# Altium project Dashboard_10.0.PrjPcb
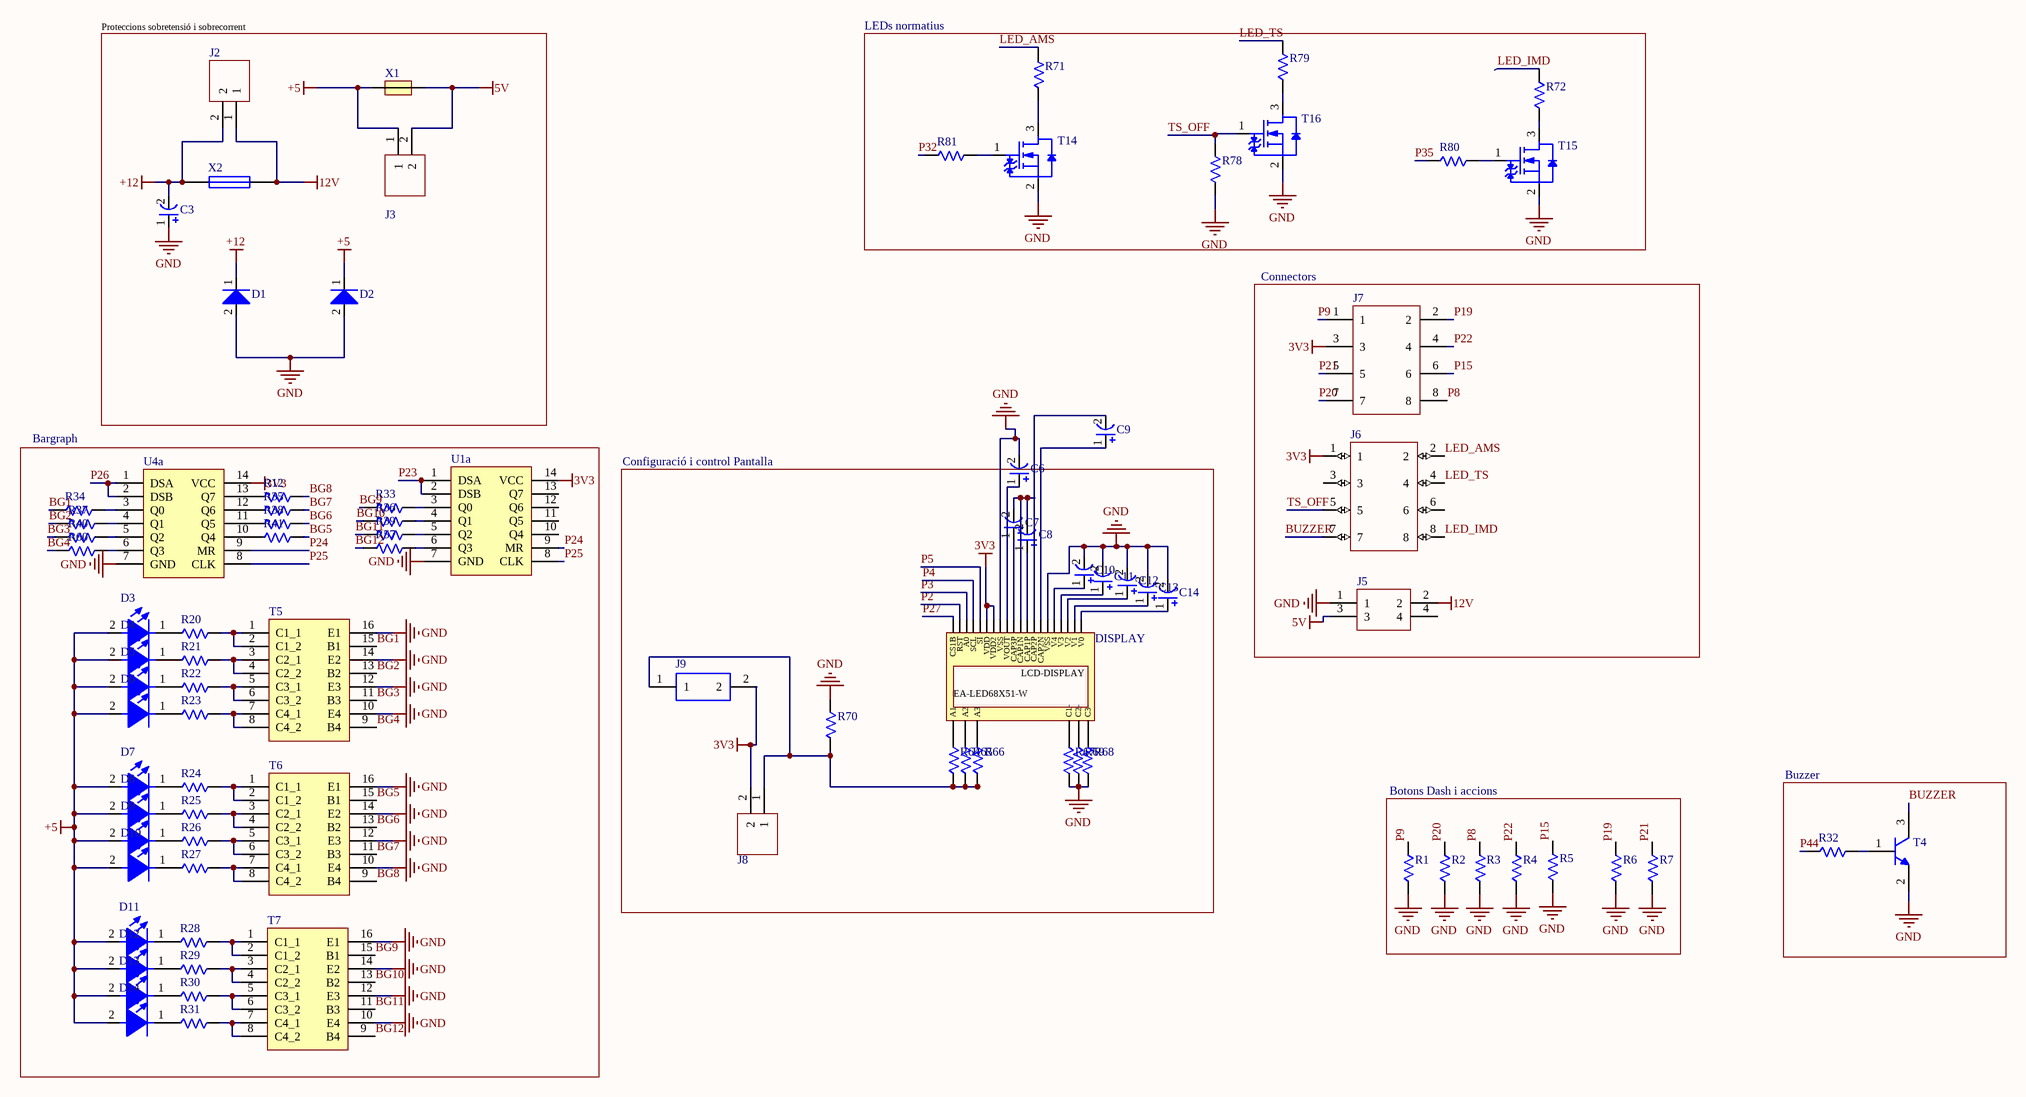
[diagram p0: DASH.SchDoc]
1 sheet, 88 parts. Net scope: global (net labels, ports and power ports of the same name join across sheets).
Board file: Dashboard_10.0.PcbDoc

## Sheet DASH.SchDoc
size A2

### Parts
C3  TAJA105K020RNJ  [Chip2PinSM127P600-8N(condensador)]  (value not drawn)
C6  TAJA105K020RNJ  [Chip2PinSM127P600-8N(condensador)]  (value not drawn)
C7  TAJA105K020RNJ  [Chip2PinSM127P600-8N(condensador)]  (value not drawn)
C8  TAJA105K020RNJ  [Chip2PinSM127P600-8N(condensador)]  (value not drawn)
C9  TAJA105K020RNJ  [Chip2PinSM127P600-8N(condensador)]  (value not drawn)
C10  TAJA105K020RNJ  [Chip2PinSM127P600-8N(condensador)]  (value not drawn)
C11  TAJA105K020RNJ  [Chip2PinSM127P600-8N(condensador)]  (value not drawn)
C12  TAJA105K020RNJ  [Chip2PinSM127P600-8N(condensador)]  (value not drawn)
C13  TAJA105K020RNJ  [Chip2PinSM127P600-8N(condensador)]  (value not drawn)
C14  TAJA105K020RNJ  [Chip2PinSM127P600-8N(condensador)]  (value not drawn)
D1  SMAJ12CA  [Diode]  (value not drawn)
D2  SMAJ12CA  [Diode]  (value not drawn)
D3  150141GS73100  [Chip2PinSM127P600-8N(Buzz)]  (value not drawn)
D4  150141GS73100  [Chip2PinSM127P600-8N(Buzz)]  (value not drawn)
D5  150141GS73100  [Chip2PinSM127P600-8N(Buzz)]  (value not drawn)
D6  150141GS73100  [Chip2PinSM127P600-8N(Buzz)]  (value not drawn)
D7  150141GS73100  [Chip2PinSM127P600-8N(Buzz)]  (value not drawn)
D8  150141GS73100  [Chip2PinSM127P600-8N(Buzz)]  (value not drawn)
D9  150141GS73100  [Chip2PinSM127P600-8N(Buzz)]  (value not drawn)
D10  150141GS73100  [Chip2PinSM127P600-8N(Buzz)]  (value not drawn)
D11  150141GS73100  [Chip2PinSM127P600-8N(Buzz)]  (value not drawn)
D12  150141GS73100  [Chip2PinSM127P600-8N(Buzz)]  (value not drawn)
D13  150141GS73100  [Chip2PinSM127P600-8N(Buzz)]  (value not drawn)
D14  150141GS73100  [Chip2PinSM127P600-8N(Buzz)]  (value not drawn)
DISPLAY  M20-7820442  [DISPLAY]  (value not drawn)
J2  68001-202HLF  [J2]  (value not drawn)
J3  68001-202HLF  [J3]  (value not drawn)
J5  1053141104  [J5]  (value not drawn)
J6  43045-0800  [J6]  (value not drawn)
J7  105314-1108  [J7]  (value not drawn)
J8  68001-202HLF  [J8]  (value not drawn)
J9  105313-1202  [J9]  (value not drawn)
R1  CRCW120610K0JNTA-ND  [ERJ-8GEYJ102V]  (value not drawn)
R2  CRCW120610K0JNTA-ND  [ERJ-8GEYJ102V]  (value not drawn)
R3  CRCW120610K0JNTA-ND  [ERJ-8GEYJ102V]  (value not drawn)
R4  CRCW120610K0JNTA-ND  [ERJ-8GEYJ102V]  (value not drawn)
R5  CRCW120610K0JNTA-ND  [ERJ-8GEYJ102V]  (value not drawn)
R6  CRCW120610K0JNTA-ND  [ERJ-8GEYJ102V]  (value not drawn)
R7  CRCW120610K0JNTA-ND  [ERJ-8GEYJ102V]  (value not drawn)
R12  ERJ-8GEYJ102V  [ERJ-8GEYJ102V]  (value not drawn)
R20  ERJ-8GEYJ151V  [ERJ-8GEYJ102V]  (value not drawn)
R21  ERJ-8GEYJ151V  [ERJ-8GEYJ102V]  (value not drawn)
R22  ERJ-8GEYJ151V  [ERJ-8GEYJ102V]  (value not drawn)
R23  ERJ-8GEYJ151V  [ERJ-8GEYJ102V]  (value not drawn)
R24  ERJ-8GEYJ151V  [ERJ-8GEYJ102V]  (value not drawn)
R25  ERJ-8GEYJ151V  [ERJ-8GEYJ102V]  (value not drawn)
R26  ERJ-8GEYJ151V  [ERJ-8GEYJ102V]  (value not drawn)
R27  ERJ-8GEYJ151V  [ERJ-8GEYJ102V]  (value not drawn)
R28  ERJ-8GEYJ151V  [ERJ-8GEYJ102V]  (value not drawn)
R29  ERJ-8GEYJ151V  [ERJ-8GEYJ102V]  (value not drawn)
R30  ERJ-8GEYJ151V  [ERJ-8GEYJ102V]  (value not drawn)
R31  ERJ-8GEYJ151V  [ERJ-8GEYJ102V]  (value not drawn)
R32  ERJ-8GEYJ102V  [ERJ-8GEYJ102V]  (value not drawn)
R33  ERJ-8GEYJ102V  [ERJ-8GEYJ102V]  (value not drawn)
R34  ERJ-8GEYJ102V  [ERJ-8GEYJ102V]  (value not drawn)
R35  ERJ-8GEYJ102V  [ERJ-8GEYJ102V]  (value not drawn)
R36  ERJ-8GEYJ102V  [ERJ-8GEYJ102V]  (value not drawn)
R37  ERJ-8GEYJ102V  [ERJ-8GEYJ102V]  (value not drawn)
R38  ERJ-8GEYJ102V  [ERJ-8GEYJ102V]  (value not drawn)
R39  ERJ-8GEYJ102V  [ERJ-8GEYJ102V]  (value not drawn)
R40  ERJ-8GEYJ102V  [ERJ-8GEYJ102V]  (value not drawn)
R41  ERJ-8GEYJ102V  [ERJ-8GEYJ102V]  (value not drawn)
R57  ERJ-8GEYJ102V  [ERJ-8GEYJ102V]  (value not drawn)
R60  ERJ-8GEYJ102V  [ERJ-8GEYJ102V]  (value not drawn)
R64  ERJ-8GEYJ102V  [ERJ-8GEYJ102V]  (value not drawn)
R65  ERJ-8GEYJ102V  [ERJ-8GEYJ102V]  (value not drawn)
R66  ERJ-8GEYJ102V  [ERJ-8GEYJ102V]  (value not drawn)
R67  ERJ-8GEYJ102V  [ERJ-8GEYJ102V]  (value not drawn)
R68  ERJ-8GEYJ102V  [ERJ-8GEYJ102V]  (value not drawn)
R69  ERJ-8GEYJ102V  [ERJ-8GEYJ102V]  (value not drawn)
R70  CRCW120610K0JNTA-ND  [ERJ-8GEYJ102V]  (value not drawn)
R71  ERJ-8GEYJ151V  [ERJ-8GEYJ102V]  (value not drawn)
R72  ERJ-8GEYJ151V  [ERJ-8GEYJ102V]  (value not drawn)
R78  CRCW120610K0JNTA-ND  [ERJ-8GEYJ102V]  (value not drawn)
R79  ERJ-8GEYJ151V  [ERJ-8GEYJ102V]  (value not drawn)
R80  ERJ-8GEYJ102V  [ERJ-8GEYJ102V]  (value not drawn)
R81  ERJ-8GEYJ102V  [ERJ-8GEYJ102V]  (value not drawn)
T4  BC817-25LT1G  [SOT190P240X100-3N]  (value not drawn)
T5  MMPQ2222A  [SOP127P600-8N(MMPQ2222A)]  (value not drawn)
T6  MMPQ2222A  [SOP127P600-8N(MMPQ2222A)]  (value not drawn)
T7  MMPQ2222A  [SOP127P600-8N(MMPQ2222A)]  (value not drawn)
T14  CPH3455-TL-H  [SOT190P280X90-3N]  (value not drawn)
T15  CPH3455-TL-H  [SOT190P280X90-3N]  (value not drawn)
T16  CPH3455-TL-H  [SOT190P280X90-3N]  (value not drawn)
U1a  SN74HC164D  [SOP127P600-8N]  (value not drawn)
U4a  SN74HC164D  [SOP127P600-8N]  (value not drawn)
X1  FUSE 3A  [Fuse]  (value not drawn)
X2  Fuse 1A  [Fuse]  (value not drawn)

### Blocks framed on the sheet
Proteccions sobretensió i sobrecorrent: C3 D1 D2 J2 J3 X1 X2
LEDs normatius: R71 R72 R78-R81 T14-T16
Connectors: J5-J7
Bargraph: D3-D14 R12 R20-R31 R33-R41 R57 R60 T5-T7 U1a U4a
Configuració i control Pantalla: C6-C8 C10-C14 DISPLAY J8 J9 R64-R70
Botons Dash i accions: R1-R7
Buzzer: R32 T4

### Nets
3V3: DISPLAY.34(VDD2) DISPLAY.35(VDD) J6.1 J7.3 J8.2 J9.2 U1a.14(VCC) U4a.14(VCC)
5V: J3.2 J5.3 X1.2
12V: J2.1 J5.2 X2.2
+5: D2.1(catode) D3.2(ANODE) D4.2(ANODE) D5.2(ANODE) D6.2(ANODE) D7.2(ANODE) D8.2(ANODE) D9.2(ANODE) D10.2(ANODE) D11.2(ANODE) D12.2(ANODE) D13.2(ANODE) D14.2(ANODE) J3.1 X1.1
+12: C3.2 D1.1(catode) J2.2 X2.1
GND: C3.1 C6.2 C10.2 C11.2 C12.2 C13.2 C14.2 D1.2(anode) D2.2(anode) DISPLAY.26(VSS) DISPLAY.33(VSS) J5.1 R1.1 R2.1 R3.1 R4.1 R5.1 R6.1 R7.1 R67.2 R68.2 R69.2 R70.2 R78.1 T4.2(Emitter) T5.10(E4) T5.12(E3) T5.14(E2) T5.16(E1) T6.10(E4) T6.12(E3) T6.14(E2) T6.16(E1) T7.10(E4) T7.12(E3) T7.14(E2) T7.16(E1) T14.2(Source) T15.2(Source) T16.2(Source) U1a.7(GND) U4a.7(GND)
BG1: R34.1 T5.15(B1)
BG2: R37.1 T5.13(B2)
BG3: R40.1 T5.11(B3)
BG4: R60.1 T5.9(B4)
BG5: R41.2 T6.15(B1)
BG6: R38.2 T6.13(B2)
BG7: R35.2 T6.11(B3)
BG8: R12.2 T6.9(B4)
BG9: R33.1 T7.15(B1)
BG10: R36.1 T7.13(B2)
BG11: R39.1 T7.11(B3)
BG12: R57.1 T7.9(B4)
BUZZER: J6.7 T4.3(Collector)
LED_AMS: J6.2 R71.2
LED_IMD: J6.8 R72.2
LED_TS: J6.4 R79.2
P2: DISPLAY.39(RST)
P3: DISPLAY.38(A0)
P4: DISPLAY.37(SCL)
P5: DISPLAY.36(SI)
P8: J7.8 R3.2
P9: J7.1 R1.2
P15: J7.6 R5.2
P19: J7.2 R6.2
P20: J7.7 R2.2
P21: J7.5 R7.2
P22: J7.4 R4.2
P23: U1a.1(DSA) U1a.2(DSB)
P24: U1a.9(MR) U4a.9(MR)
P25: U1a.8(CLK) U4a.8(CLK)
P26: U4a.1(DSA) U4a.2(DSB)
P27: DISPLAY.40(CS1B)
P32: R81.1
P35: R80.1
P44: R32.1
TS_OFF: J6.5 R78.2 T16.1(Gate)
NetC6_1: C6.1 DISPLAY.32(VOUT)
NetC7_1: C7.1 DISPLAY.31(CAP3P)
NetC7_2: C7.2 C8.2 DISPLAY.30(CAP1N)
NetC8_1: C8.1 DISPLAY.29(CAP1P)
NetC9_1: C9.1 DISPLAY.27(CAP2N)
NetC9_2: C9.2 DISPLAY.28(CAP2P)
NetC10_1: C10.1 DISPLAY.25(V4)
NetC11_1: C11.1 DISPLAY.24(V3)
NetC12_1: C12.1 DISPLAY.23(V2)
NetC13_1: C13.1 DISPLAY.22(V1)
NetC14_1: C14.1 DISPLAY.21(V0)
NetD3_1: D3.1(CATODE) R20.1
NetD4_1: D4.1(CATODE) R21.1
NetD5_1: D5.1(CATODE) R22.1
NetD6_1: D6.1(CATODE) R23.1
NetD7_1: D7.1(CATODE) R24.1
NetD8_1: D8.1(CATODE) R25.1
NetD9_1: D9.1(CATODE) R26.1
NetD10_1: D10.1(CATODE) R27.1
NetD11_1: D11.1(CATODE) R28.1
NetD12_1: D12.1(CATODE) R29.1
NetD13_1: D13.1(CATODE) R30.1
NetD14_1: D14.1(CATODE) R31.1
NetDISPLAY_41: DISPLAY.41(A1) R64.2
NetDISPLAY_42: DISPLAY.42(A2) R65.2
NetDISPLAY_43: DISPLAY.43(A3) R66.2
NetDISPLAY_44: DISPLAY.44(C3-) R68.1
NetDISPLAY_45: DISPLAY.45(C2-) R69.1
NetDISPLAY_46: DISPLAY.46(C1-) R67.1
NetJ8_1: J8.1 J9.1 R64.1 R65.1 R66.1 R70.1
NetR12_1: R12.1 U4a.13(Q7)
NetR20_2: R20.2 T5.1(C1_1) T5.2(C1_2)
NetR21_2: R21.2 T5.3(C2_1) T5.4(C2_2)
NetR22_2: R22.2 T5.5(C3_1) T5.6(C3_2)
NetR23_2: R23.2 T5.7(C4_1) T5.8(C4_2)
NetR24_2: R24.2 T6.1(C1_1) T6.2(C1_2)
NetR25_2: R25.2 T6.3(C2_1) T6.4(C2_2)
NetR26_2: R26.2 T6.5(C3_1) T6.6(C3_2)
NetR27_2: R27.2 T6.7(C4_1) T6.8(C4_2)
NetR28_2: R28.2 T7.1(C1_1) T7.2(C1_2)
NetR29_2: R29.2 T7.3(C2_1) T7.4(C2_2)
NetR30_2: R30.2 T7.5(C3_1) T7.6(C3_2)
NetR31_2: R31.2 T7.7(C4_1) T7.8(C4_2)
NetR32_2: R32.2 T4.1(Base)
NetR33_2: R33.2 U1a.3(Q0)
NetR34_2: R34.2 U4a.3(Q0)
NetR35_1: R35.1 U4a.12(Q6)
NetR36_2: R36.2 U1a.4(Q1)
NetR37_2: R37.2 U4a.4(Q1)
NetR38_1: R38.1 U4a.11(Q5)
NetR39_2: R39.2 U1a.5(Q2)
NetR40_2: R40.2 U4a.5(Q2)
NetR41_1: R41.1 U4a.10(Q4)
NetR57_2: R57.2 U1a.6(Q3)
NetR60_2: R60.2 U4a.6(Q3)
NetR71_1: R71.1 T14.3(Drain)
NetR72_1: R72.1 T15.3(Drain)
NetR79_1: R79.1 T16.3(Drain)
NetR80_2: R80.2 T15.1(Gate)
NetR81_2: R81.2 T14.1(Gate)

Not connected (* = marked no-connect by the designer): J5 4; J6 3 6; U1a 10(Q4) 11(Q5) 12(Q6) 13(Q7)

### Notes on the sheet
- (in symbol DISPLAY) LCD-DISPLAY; EA-LED68X51-W

### Library data of the parts
C3 = CONDENSADOR 100nF: CAP TANT 100nF 20V 10% 1206; Manufacturer 1: Kyocera AVX; Dielectric Material: Tantalum; Capacitance: 1uF; Tolerance: 20%; ESR (Equivalent Series Resistance): 9R; Leakage Current: 500nA; Polarity: Polar; Dissipation Factor: 4%; Supplier 1: Digi-Key; Manufacturer Part Number 1: TAJA105K020RNJ; Stock 1: 73338; Pricing 1: 1=0,31000, 10=0,21900, 100=0,13110, 500=0,09832, 1000=0,08303 (USD); RoHS: Yes; Mount: Surface Mount,PCB; Case/Package: 1206; Number of Pins: 2; Case Code (Imperial): 1206; Case Code (Metric): 3216; Min Operating Temperature: -55°C; Max Operating Temperature: 125°C; Voltage Rating: 20V; Voltage Rating (DC): 20V; Package Quantity: 1; Packaging: Tape and Reel; Termination: SMD/SMT; Voltage: 20V; Features: General Purpose; Length: 3.2mm; Height: 1.6mm; Width: 1.6mm; Height - Seated (Max): 0.071inch; Depth: 1.6mm; Radiation Hardening: No; REACH SVHC: No SVHC; Lead Free: Lead Free; ComponentLink1URL: https://datasheet.ciiva.com/12883/taj-27497-12883280.pdf?src-supplier=Mouser; ComponentLink1Description: https://datasheet.ciiva.com/12883/taj-27497-12883280.pdf?src-supplier=Mouser; ComponentLink2URL: https://datasheet.ciiva.com/11794/0900766b80ccdc61-11794382.pdf?src-supplier=RSComponents; ComponentLink2Description: https://datasheet.ciiva.com/11794/0900766b80ccdc61-11794382.pdf?src-supplier=RSComponents; ComponentLink3URL: https://datasheet.ciiva.com/263/taj-263412.pdf?src-supplier=Digi-Key; ComponentLink3Description: https://datasheet.ciiva.com/263/taj-263412.pdf?src-supplier=Digi-Key; ComponentLink4URL: https://datasheet.ciiva.com/3004/taj-3004372.pdf?src-supplier=Avnet; ComponentLink4Description: https://datasheet.ciiva.com/3004/taj-3004372.pdf?src-supplier=Avnet; ComponentLink5URL: https://datasheet.ciiva.com/263/taj-263414.pdf?src-supplier=Digi-Key; ComponentLink5Description: https://datasheet.ciiva.com/263/taj-263414.pdf?src-supplier=Digi-Key; ComponentLink6URL: https://datasheet.ciiva.com/263/taj-263413.pdf?src-supplier=Digi-Key; ComponentLink6Description: https://datasheet.ciiva.com/263/taj-263413.pdf?src-supplier=Digi-Key; ComponentLink7URL: https://datasheet.ciiva.com/3004/taj-3004373.pdf?src-supplier=Avnet; ComponentLink7Description: https://datasheet.ciiva.com/3004/taj-3004373.pdf?src-supplier=Avnet; ComponentLink8URL: https://datasheet.ciiva.com/14608/70001050-14608053.pdf?src-supplier=Allied+Electronics; ComponentLink8Description: https://datasheet.ciiva.com/14608/70001050-14608053.pdf?src-supplier=Allied+Electronics; ComponentLink9URL: https://datasheet.ciiva.com/14598/70001050-14598921.pdf?src-supplier=Allied+Electronics; ComponentLink9Description: https://datasheet.ciiva.com/14598/70001050-14598921.pdf?src-supplier=Allied+Electronics; ComponentLink10URL: https://datasheet.ciiva.com/16486/taj-16486073.pdf?src-supplier=Avnet+Asia; ComponentLink10Description: https://datasheet.ciiva.com/16486/taj-16486073.pdf?src-supplier=Avnet+Asia; ComponentLink11URL: https://datasheet.ciiva.com/16203/taj-16203563.pdf?src-supplier=Future+Electronics; ComponentLink11Description: https://datasheet.ciiva.com/16203/taj-16203563.pdf?src-supplier=Future+Electronics; Supplier Part Number 1: 478-1650-1-ND; Category: condensador
C6-C14 = CONDENSADOR 1uF: CAP TANT 1uF 20V 10% 1206; Manufacturer 1: Kyocera AVX; Dielectric Material: Tantalum; Tolerance: 20%; ESR (Equivalent Series Resistance): 9R; Leakage Current: 500nA; Polarity: Polar; Dissipation Factor: 4%; Supplier 1: Digi-Key; Manufacturer Part Number 1: TAJA105K020RNJ; Stock 1: 73338; Pricing 1: 1=0,31000, 10=0,21900, 100=0,13110, 500=0,09832, 1000=0,08303 (USD); RoHS: Yes; Mount: Surface Mount,PCB; Case/Package: 1206; Number of Pins: 2; Case Code (Imperial): 1206; Case Code (Metric): 3216; Min Operating Temperature: -55°C; Max Operating Temperature: 125°C; Capacitance: 1uF; Voltage Rating: 20V; Voltage Rating (DC): 20V; Package Quantity: 1; Packaging: Tape and Reel; Termination: SMD/SMT; Voltage: 20V; Features: General Purpose; Length: 3.2mm; Height: 1.6mm; Width: 1.6mm; Height - Seated (Max): 0.071inch; Depth: 1.6mm; Radiation Hardening: No; REACH SVHC: No SVHC; Lead Free: Lead Free; ComponentLink1URL: https://datasheet.ciiva.com/12883/taj-27497-12883280.pdf?src-supplier=Mouser; ComponentLink1Description: https://datasheet.ciiva.com/12883/taj-27497-12883280.pdf?src-supplier=Mouser; ComponentLink2URL: https://datasheet.ciiva.com/11794/0900766b80ccdc61-11794382.pdf?src-supplier=RSComponents; ComponentLink2Description: https://datasheet.ciiva.com/11794/0900766b80ccdc61-11794382.pdf?src-supplier=RSComponents; ComponentLink3URL: https://datasheet.ciiva.com/263/taj-263412.pdf?src-supplier=Digi-Key; ComponentLink3Description: https://datasheet.ciiva.com/263/taj-263412.pdf?src-supplier=Digi-Key; ComponentLink4URL: https://datasheet.ciiva.com/3004/taj-3004372.pdf?src-supplier=Avnet; ComponentLink4Description: https://datasheet.ciiva.com/3004/taj-3004372.pdf?src-supplier=Avnet; ComponentLink5URL: https://datasheet.ciiva.com/263/taj-263414.pdf?src-supplier=Digi-Key; ComponentLink5Description: https://datasheet.ciiva.com/263/taj-263414.pdf?src-supplier=Digi-Key; ComponentLink6URL: https://datasheet.ciiva.com/263/taj-263413.pdf?src-supplier=Digi-Key; ComponentLink6Description: https://datasheet.ciiva.com/263/taj-263413.pdf?src-supplier=Digi-Key; ComponentLink7URL: https://datasheet.ciiva.com/3004/taj-3004373.pdf?src-supplier=Avnet; ComponentLink7Description: https://datasheet.ciiva.com/3004/taj-3004373.pdf?src-supplier=Avnet; ComponentLink8URL: https://datasheet.ciiva.com/14608/70001050-14608053.pdf?src-supplier=Allied+Electronics; ComponentLink8Description: https://datasheet.ciiva.com/14608/70001050-14608053.pdf?src-supplier=Allied+Electronics; ComponentLink9URL: https://datasheet.ciiva.com/14598/70001050-14598921.pdf?src-supplier=Allied+Electronics; ComponentLink9Description: https://datasheet.ciiva.com/14598/70001050-14598921.pdf?src-supplier=Allied+Electronics; ComponentLink10URL: https://datasheet.ciiva.com/16486/taj-16486073.pdf?src-supplier=Avnet+Asia; ComponentLink10Description: https://datasheet.ciiva.com/16486/taj-16486073.pdf?src-supplier=Avnet+Asia; ComponentLink11URL: https://datasheet.ciiva.com/16203/taj-16203563.pdf?src-supplier=Future+Electronics; ComponentLink11Description: https://datasheet.ciiva.com/16203/taj-16203563.pdf?src-supplier=Future+Electronics; Supplier Part Number 1: 478-1650-1-ND; Category: condensador
D1 D2 = DIODE: TVS DIODE 12V 19.9V DO214AC; Manufacturer 1: Littelfuse; Peak Pulse Power: 400W; Polarity: Bidirectional; Peak Pulse Current: 20.1A; Test Current: 1mA; Reverse Breakdown Voltage: 13.3V; Number of Elements: 1; Leakage Current: 1uA; Element Configuration: Single; Power Line Protection: No; Max Breakdown Voltage: 14.7V; Max Power Dissipation: 3.3W; Capacitance: 800pF; Supplier 1: Digi-Key; Manufacturer Part Number 1: SMAJ12CA; Stock 1: 18116; Pricing 1: 1=0,45000, 10=0,33900, 25=0,30520, 100=0,16100, 250=0,15928, 500=0,14264, 1000=0,11100, 2500=0,10156 (USD); RoHS: Yes; Mount: Surface Mount; Case/Package: SMA; Number of Pins: 2; Min Operating Temperature: -65°C; Max Operating Temperature: 150°C; Clamping Voltage: 19.9V; Packaging: Tape and Reel; Reverse Standoff Voltage: 12V; Package Quantity: 5000; Breakdown Voltage: 13.3V; Max Surge Current: 20.1A; Min Breakdown Voltage: 13.3V; Operating Supply Voltage: 12V; Direction: Bidirectional; Number of Channels: 1; Max Reverse Leakage Current: 1uA; Termination: SMD/SMT; Composition: Zener; Number of Bidirectional Channels: 1; Power Dissipation: 400W; Voltage Rating (DC): 12V; Max Output Current: 20.1A; Length: 4.5mm; Height: 2.087mm; Width: 2.79mm; Radiation Hardening: No; Lead Free: Lead Free; REACH SVHC: No SVHC; ComponentLink1URL: https://datasheet.ciiva.com/14162/smaj-eng-ds-14162034.pdf?src-supplier=Distrelec; ComponentLink1Description: https://datasheet.ciiva.com/14162/smaj-eng-ds-14162034.pdf?src-supplier=Distrelec; ComponentLink2URL: https://datasheet.ciiva.com/25624/0900766b810f4edb-25624831.pdf?src-supplier=RSComponents; ComponentLink2Description: https://datasheet.ciiva.com/25624/0900766b810f4edb-25624831.pdf?src-supplier=RSComponents; ComponentLink3URL: https://datasheet.ciiva.com/331/littelfuse-tvs-diode-smaj-datasheet-pdf-331080.pdf?src-supplier=Digi-Key; ComponentLink3Description: https://datasheet.ciiva.com/331/littelfuse-tvs-diode-smaj-datasheet-pdf-331080.pdf?src-supplier=Digi-Key; ComponentLink4URL: https://datasheet.ciiva.com/8062/littelfuse-tvs-diode-smaj-8062265.pdf?src-supplier=Element14; ComponentLink4Description: https://datasheet.ciiva.com/8062/littelfuse-tvs-diode-smaj-8062265.pdf?src-supplier=Element14; ComponentLink5URL: https://datasheet.ciiva.com/4511/littelfuse-tvs-diode-smaj-23503-4511037.pdf?src-supplier=Mouser; ComponentLink5Description: https://datasheet.ciiva.com/4511/littelfuse-tvs-diode-smaj-23503-4511037.pdf?src-supplier=Mouser; ComponentLink6URL: https://datasheet.ciiva.com/28473/607617-28473381.pdf?src-supplier=Element14; ComponentLink6Description: https://datasheet.ciiva.com/28473/607617-28473381.pdf?src-supplier=Element14; ComponentLink7URL: https://datasheet.ciiva.com/331/littelfuse-tvs-diode-smaj-datasheet-pdf-331078.pdf?src-supplier=Digi-Key; ComponentLink7Description: https://datasheet.ciiva.com/331/littelfuse-tvs-diode-smaj-datasheet-pdf-331078.pdf?src-supplier=Digi-Key; ComponentLink8URL: https://datasheet.ciiva.com/331/littelfuse-tvs-diode-smaj-datasheet-pdf-331079.pdf?src-supplier=Digi-Key; ComponentLink8Description: https://datasheet.ciiva.com/331/littelfuse-tvs-diode-smaj-datasheet-pdf-331079.pdf?src-supplier=Digi-Key; Supplier Part Number 1: SMAJ12CALFCT-ND; Category: Diode
D3-D14 = LED: WURTH ELEKTRONIK   150141GS73100   LED, 1411, GREEN, 1000MCD, 525NM; Manufacturer 1: Wurth Electronics; Viewing Angle: 120°; Forward Voltage: 3.1V; Lens Style: Clear,Round; Forward Current: 30mA; Test Current: 20mA; Supplier 1: Digi-Key; Manufacturer Part Number 1: 150141GS73100; Stock 1: 10639; Pricing 1: 1=0,18000, 50=0,17600, 100=0,15300, 500=0,11700 (USD); RoHS: Yes; Mount: Surface Mount; Case/Package: 3528; Color: Green; Case Code (Metric): 3528; Case Code (Imperial): 1411; Min Operating Temperature: -40°C; Max Operating Temperature: 85°C; Luminous Intensity: 1000mcd; Wavelength: 525nm; Packaging: Cut Tape; Package Quantity: 2000; Dominant Wavelength: 525nm; Length: 3.5mm; Height: 1.9mm; Width: 2.8mm; REACH SVHC: Unknown; Lead Free: Lead Free; ComponentLink1URL: https://datasheet.ciiva.com/23843/150141gs73100-23843266.pdf?src-supplier=Newark; ComponentLink1Description: https://datasheet.ciiva.com/23843/150141gs73100-23843266.pdf?src-supplier=Newark; ComponentLink2URL: https://datasheet.ciiva.com/29278/759463-da-01-en-smd-topled-einf-gruen-150141gs73100-29278953.pdf?src-supplier=Conrad; ComponentLink2Description: https://datasheet.ciiva.com/29278/759463-da-01-en-smd-topled-einf-gruen-150141gs73100-29278953.pdf?src-supplier=Conrad; ComponentLink3URL: https://datasheet.ciiva.com/22656/1911484-22656997.pdf?src-supplier=Element14; ComponentLink3Description: https://datasheet.ciiva.com/22656/1911484-22656997.pdf?src-supplier=Element14; ComponentLink4URL: https://datasheet.ciiva.com/29563/150141gs73100-29563029.pdf?src-supplier=Digi-Key; ComponentLink4Description: https://datasheet.ciiva.com/29563/150141gs73100-29563029.pdf?src-supplier=Digi-Key; ComponentLink5URL: https://datasheet.ciiva.com/29563/150141gs73100-29563030.pdf?src-supplier=Digi-Key; ComponentLink5Description: https://datasheet.ciiva.com/29563/150141gs73100-29563030.pdf?src-supplier=Digi-Key; ComponentLink6URL: https://datasheet.ciiva.com/48430/150141gs73100-eng-tds-48430060.pdf?src-supplier=Distrelec; ComponentLink6Description: https://datasheet.ciiva.com/48430/150141gs73100-eng-tds-48430060.pdf?src-supplier=Distrelec; Supplier Part Number 1: 732-4997-1-ND
DISPLAY = DISPLAY: 2.54mm (0.1") Pitch SIL Vertical PC Tail Socket Assembly, selective gold + tin, 4 contacts; Manufacturer 1: Harwin; Number of Contacts: 4; Max Current Rating: 3A; Contact Resistance: 20mR; Connector Type: Receptacle,Socket; Gender: Female; Supplier 1: Digi-Key; Manufacturer Part Number 1: M20-7820442; Stock 1: 903; Pricing 1: 1=0,81000, 10=0,71400, 100=0,61600, 500=0,50400, 1000=0,44800, 5000=0,39200, 10000=0,37240 (USD); RoHS: Yes; Mount: Through Hole; Case/Package: SIL; Weight: 0.012699oz; Contact Plating: Gold,Tin; Color: Black; Contact Material: Bronze; Housing Color: Black; Housing Material: Nylon; Min Operating Temperature: -40°C; Max Operating Temperature: 105°C; Number of Rows: 1; Termination: Solder; Packaging: Rail/Tube; Contact Gender: Female; Package Quantity: 56; Number of Positions: 4; Orientation: Straight; Length: 10.56mm; Pitch: 2.54mm; Depth: 2.5mm; Radiation Hardening: No; Supplier Part Number 1: 952-1791-ND; ComponentLink1Description: DATASHEET; ComponentLink1URL: https://eu.mouser.com/datasheet/2/127/dogl128-6e-3984.pdf; ComponentLink2Description: WHERE BUY IT; ComponentLink2URL: https://eu.mouser.com/productdetail/electronic-assembly/ea-led68x51-w?qs=7%252buJNxjmPmV34T7aeje2sQ==
J2 J3 J8 = HEADER: CONN HEADER VERT 2POS 2.54MM; Manufacturer 1: Amphenol FCI; Number of Contacts: 2; Current Rating: 3A; Voltage Rating: 1.5kV; Insulation Resistance: 5GR; Gender: Male; Connector Type: Male Pin; Contact Post Length: 3.05mm; Supplier 1: Digi-Key; Manufacturer Part Number 1: 68001-202HLF; Stock 1: 39971; Pricing 1: 1=0,24000, 10=0,22100, 100=0,15290, 500=0,12936, 1000=0,10584, 5000=0,09408, 10000=0,08526 (USD); RoHS: Yes; Mount: Through Hole; Contact Plating: Gold,GXT; Contact Material: Bronze; Color: Black; Housing Color: Black; Housing Material: Thermoplastic; Min Operating Temperature: -65°C; Max Operating Temperature: 125°C; Number of Rows: 1; Termination: Solder; Contact Gender: Male; Packaging: Bulk; Package Quantity: 100; Number of Positions: 2; Max Voltage Rating (AC): 1.5kV; Orientation: Straight; Length: 5.08mm; Pitch: 2.54mm; Contact Mating Length: 0.23inch; Depth: 2.41mm; Radiation Hardening: No; REACH SVHC: No SVHC; Flammability Rating: UL94 V-0; ComponentLink1URL: https://datasheet.ciiva.com/5155/68000-274330-5155060.pdf?src-supplier=Mouser; ComponentLink1Description: https://datasheet.ciiva.com/5155/68000-274330-5155060.pdf?src-supplier=Mouser; ComponentLink2URL: https://datasheet.ciiva.com/16726/68000-16726182.pdf?src-supplier=Avnet+Europe; ComponentLink2Description: https://datasheet.ciiva.com/16726/68000-16726182.pdf?src-supplier=Avnet+Europe; ComponentLink3URL: https://datasheet.ciiva.com/10149/68000-10149336.pdf?src-supplier=Avnet; ComponentLink3Description: https://datasheet.ciiva.com/10149/68000-10149336.pdf?src-supplier=Avnet; ComponentLink4URL: https://datasheet.ciiva.com/731/68000-731070.pdf?src-supplier=Digi-Key; ComponentLink4Description: https://datasheet.ciiva.com/731/68000-731070.pdf?src-supplier=Digi-Key; Supplier Part Number 1: 609-3469-ND; Category: Connector
J5 = HEADER_J5: NANO-FIT RIGHT ANGLE HEADER, TH; Manufacturer 1: Molex; Connector Type: Header,Male Pin; Number of Positions: 4; Supplier 1: Digi-Key; Manufacturer Part Number 1: 1053141104; Stock 1: 1022; Pricing 1: 1=1,08000, 10=0,95100, 300=0,74580, 600=0,67122, 1200=0,59664, 5100=0,52206, 10200=0,49596 (USD); RoHS: No; Mount: Through Hole; Contact Plating: Tin; Contact Material: Brass; Contact Shape: Square; Insulation Material: Polymer; Insulation Color: Black; Min Operating Temperature: -40°C; Max Operating Temperature: 105°C; Fastening Type: Latch; Packaging: Tray; Number of Rows: 2; Termination: Solder; ComponentLink1URL: https://www.molex.com/pdm_docs/ps/PS-105300-100-001.pdf?src-supplier=Digi-Key; ComponentLink1Description: https://www.molex.com/pdm_docs/ps/PS-105300-100-001.pdf?src-supplier=Digi-Key; Supplier Part Number 1: WM16907-ND
J6 = HEADER_J6: CONN HEADER R/A 8POS 3MM; Manufacturer 1: Molex; Number of Contacts: 8; Contact Resistance: 10mR; Max Voltage Rating (DC): 250.25kV; Current Rating: 5A; Voltage Rating (AC): 250V; Voltage Rating: 600V; Gender: Male; Insulation Resistance: 1GR; Approvals: UL,CSA,TUV; Glow Wire Compliant: Compliant; Supplier 1: Digi-Key; Manufacturer Part Number 1: 43045-0800; Stock 1: 1548; Pricing 1: 1=1,91000, 10=1,73100, 100=1,48390, 500=1,23656, 1000=1,05990, 5000=0,93978, 10000=0,91858 (USD); RoHS: Yes; Mount: Through Hole; Case/Package: SMC; Contact Plating: Tin; Contact Material: Brass,Tin; Color: Black; Housing Color: Black; Housing Material: Thermoplastic; Material: Polyester; Min Operating Temperature: -40°C; Max Operating Temperature: 105°C; Number of Rows: 2; Termination: Solder; Packaging: Tray; Number of Positions: 8; Orientation: Right Angle; Number of Poles: 8; Package Quantity: 1440; Max Current Rating: 5A; Number of Circuits: 8; Working Voltage: 250V; Voltage Rating (DC): 250V; Diameter: 3mm; Length: 16.15mm; Height: 8.77mm; Pitch: 3mm; Row Spacing: 3mm; Depth: 12.2mm; Radiation Hardening: No; Flammability Rating: UL94 V-0; REACH SVHC: Unknown; Halogen Free: Low Halogen; Lead Free: Lead Free; ComponentLink1URL: https://datasheet.ciiva.com/5158/0430450800-pcb-headers-142625-5158817.pdf?src-supplier=Mouser; ComponentLink1Description: https://datasheet.ciiva.com/5158/0430450800-pcb-headers-142625-5158817.pdf?src-supplier=Mouser; ComponentLink2URL: https://datasheet.ciiva.com/7683/27645-7683683.pdf?src-supplier=Element14; ComponentLink2Description: https://datasheet.ciiva.com/7683/27645-7683683.pdf?src-supplier=Element14; ComponentLink3URL: https://datasheet.ciiva.com/19462/883536-19462164.pdf?src-supplier=Jameco; ComponentLink3Description: https://datasheet.ciiva.com/19462/883536-19462164.pdf?src-supplier=Jameco; ComponentLink4URL: https://datasheet.ciiva.com/11751/0900766b80027348-11751142.pdf?src-supplier=RSComponents; ComponentLink4Description: https://datasheet.ciiva.com/11751/0900766b80027348-11751142.pdf?src-supplier=RSComponents; ComponentLink5URL: https://datasheet.ciiva.com/30198/267770430450800-pcb-headers-30198875.pdf?src-supplier=Onlinecomponents.com; ComponentLink5Description: https://datasheet.ciiva.com/30198/267770430450800-pcb-headers-30198875.pdf?src-supplier=Onlinecomponents.com; ComponentLink6URL: https://datasheet.ciiva.com/1443/1850016-1443537.pdf?src-supplier=Element14; ComponentLink6Description: https://datasheet.ciiva.com/1443/1850016-1443537.pdf?src-supplier=Element14; ComponentLink7URL: https://datasheet.ciiva.com/14155/04402310-14155206.pdf?src-supplier=Distrelec; ComponentLink7Description: https://datasheet.ciiva.com/14155/04402310-14155206.pdf?src-supplier=Distrelec; ComponentLink8URL: https://datasheet.ciiva.com/16657/0430450800-pcb-headers-16657964.pdf?src-supplier=Avnet+Europe; ComponentLink8Description: https://datasheet.ciiva.com/16657/0430450800-pcb-headers-16657964.pdf?src-supplier=Avnet+Europe; ComponentLink9URL: https://datasheet.ciiva.com/10087/0430450800-pcb-headers-10087853.pdf?src-supplier=Avnet; ComponentLink9Description: https://datasheet.ciiva.com/10087/0430450800-pcb-headers-10087853.pdf?src-supplier=Avnet; Supplier Part Number 1: WM1816-ND
J7 = HEADER_J7: Conn Power HDR 8 POS 2.5mm Solder RA Thru-Hole 8 Terminal 1 Port Nano-Fit Tray; Manufacturer 1: Molex; Connector Type: Header,Male Pin; Number of Positions: 8; Supplier 1: Digi-Key; Manufacturer Part Number 1: 105314-1108; Stock 1: 846; Pricing 1: 1=1,71000, 10=1,55200, 156=1,33013, 624=1,10845, 1092=0,95010, 5148=0,84242, 10140=0,82342 (USD); RoHS: No; Mount: Through Hole; Contact Plating: Tin; Contact Material: Brass; Contact Shape: Square; Insulation Material: Polymer; Insulation Color: Black; Min Operating Temperature: -40°C; Max Operating Temperature: 105°C; Fastening Type: Latch; Packaging: Tray; Number of Rows: 2; Termination: Solder; ComponentLink1URL: https://www.molex.com/pdm_docs/sd/1053141108_sd.pdf?src-supplier=Digi-Key; ComponentLink1Description: Datasheet; Supplier Part Number 1: WM16909-ND; ComponentLink2Description: INFO; ComponentLink2URL: https://www.molex.com/molex/products/part-detail/pcb_headers/1053141108
J9 = HEADER_J9: CONN HEADER R/A 2POS 2.5MM; Manufacturer 1: Molex; Gender: Male; Supplier 1: RSComponents; Manufacturer Part Number 1: 105313-1202; Stock 1: 130; Pricing 1: 10=0,81300, 50=0,47400, 200=0,46200, 500=0,45000 (EUR); RoHS: No; Mount: Through Hole; Number of Pins: 2; Contact Plating: Gold; Contact Material: Brass; Color: Black; Termination: Through Hole; Number of Rows: 1; REACH SVHC: Unknown; ComponentLink1URL: http://www.farnell.com/datasheets/2221462.pdf?src-supplier=Farnell; ComponentLink1Description: http://www.farnell.com/datasheets/2221462.pdf?src-supplier=Farnell; ComponentLink2URL: http://www.farnell.com/datasheets/2059602.pdf?src-supplier=Element14; ComponentLink2Description: http://www.farnell.com/datasheets/2059602.pdf?src-supplier=Element14; ComponentLink3URL: http://www.farnell.com/datasheets/2221462.pdf?src-supplier=Newark; ComponentLink3Description: http://www.farnell.com/datasheets/2221462.pdf?src-supplier=Newark; ComponentLink4URL: https://www.molex.com/pdm_docs/sd/1053131102_sd.pdf?src-supplier=Digi-Key; ComponentLink4Description: https://www.molex.com/pdm_docs/sd/1053131102_sd.pdf?src-supplier=Digi-Key; Supplier Part Number 1: 1225083
R1-R7 R70 R78 = RESISTOR 10K: RES SMD 10K OHM 5% 1/4W 1206; Manufacturer 1: Vishay Dale; Resistance: 10kR; Power Rating: 250mW; Voltage Rating: 200V; Temperature Coefficient: 200ppm/°C; Supplier 1: Avnet; Manufacturer Part Number 1: CRCW120610K0JNTA; Stock 1: 5000; Pricing 1: 5000=0,02620, 10000=0,02542, 20000=0,02439, 30000=0,02372, 50000=0,02308 (USD); RoHS: Yes; Case/Package: 1206; Weight: 0.000353oz; Case Code (Metric): 3216; Case Code (Imperial): 1206; Contact Plating: Tin,Lead; Min Operating Temperature: -55°C; Max Operating Temperature: 155°C; Tolerance: 5%; Package Quantity: 5000; Packaging: Tape and Reel; Composition: Thick Film; Number of Terminations: 2; Termination: SMD/SMT; Military Standard: Not; Max Power Dissipation: 250mW; Voltage Rating (DC): 200V; Power Dissipation: 250mW; Features: Automotive AEC-Q200; Length: 3.2mm; Height: 0.024inch; Width: 0.063inch; Depth: 1.6mm; Radiation Hardening: No; Lead Free: Contains Lead; ComponentLink1URL: https://datasheet.ciiva.com/2567/dcrcw-2567803.pdf?src-supplier=Digi-Key; ComponentLink1Description: https://datasheet.ciiva.com/2567/dcrcw-2567803.pdf?src-supplier=Digi-Key; ComponentLink2URL: https://datasheet.ciiva.com/9052/dcrcw-9052558.pdf?src-supplier=Avnet; ComponentLink2Description: https://datasheet.ciiva.com/9052/dcrcw-9052558.pdf?src-supplier=Avnet; Supplier Part Number 1: CRCW120610K0JNTA
R12 R32-R41 R57 R60 R80 R81 = RESISTOR 1K: Res Thick Film 1206(3216) 1K Ohm 5% 1/4W 200ppm/C Molded SMD Punched Carrier T/R; Manufacturer 1: Panasonic; Resistance: 1kR; Temperature Coefficient: 200ppm/°C; Power Rating: 250mW; Voltage Rating: 200V; Categoría: Resistencia; Supplier 1: Digi-Key; Manufacturer Part Number 1: ERJ-8GEYJ102V; Stock 1: 1414216; Pricing 1: 1=0,10000, 10=0,07400, 100=0,03010, 1000=0,01351, 2500=0,01172 (USD); RoHS: Yes; Mount: Surface Mount; Case/Package: 1206; Case Code (Metric): 3216; Case Code (Imperial): 1206; Contact Plating: Tin; Min Operating Temperature: -55°C; Max Operating Temperature: 155°C; Tolerance: 5%; Packaging: Tape and Reel; Composition: Thick Film; Package Quantity: 1; Number of Terminations: 2; Max Power Dissipation: 250mW; Voltage Rating (DC): 200V; Features: Automotive AEC-Q200; Termination: SMD/SMT; Military Standard: Not; Width: 0.063inch; Radiation Hardening: No; Lead Free: Lead Free; REACH SVHC: Unknown; ComponentLink1URL: https://datasheet.ciiva.com/24069/aoa0000ce1-37422-24069653.pdf?src-supplier=Mouser; ComponentLink1Description: https://datasheet.ciiva.com/24069/aoa0000ce1-37422-24069653.pdf?src-supplier=Mouser; ComponentLink2URL: https://datasheet.ciiva.com/30141/4aoa0000ce1-30141014.pdf?src-supplier=Onlinecomponents.com; ComponentLink2Description: https://datasheet.ciiva.com/30141/4aoa0000ce1-30141014.pdf?src-supplier=Onlinecomponents.com; ComponentLink3URL: https://datasheet.ciiva.com/43460/1500035-43460230.pdf?src-supplier=Farnell; ComponentLink3Description: https://datasheet.ciiva.com/43460/1500035-43460230.pdf?src-supplier=Farnell; ComponentLink4URL: https://datasheet.ciiva.com/17215/aoa0000ce1-17215321.pdf?src-supplier=Avnet+Europe; ComponentLink4Description: https://datasheet.ciiva.com/17215/aoa0000ce1-17215321.pdf?src-supplier=Avnet+Europe; ComponentLink5URL: https://datasheet.ciiva.com/46371/1500035-46371931.pdf?src-supplier=Element14; ComponentLink5Description: https://datasheet.ciiva.com/46371/1500035-46371931.pdf?src-supplier=Element14; ComponentLink6URL: https://datasheet.ciiva.com/28532/1678796-28532156.pdf?src-supplier=Element14; ComponentLink6Description: https://datasheet.ciiva.com/28532/1678796-28532156.pdf?src-supplier=Element14; ComponentLink7URL: https://datasheet.ciiva.com/46386/1500035-46386461.pdf?src-supplier=Element14; ComponentLink7Description: https://datasheet.ciiva.com/46386/1500035-46386461.pdf?src-supplier=Element14; ComponentLink8URL: https://datasheet.ciiva.com/48532/aoa0000ce1-48532159.pdf?src-supplier=Avnet; ComponentLink8Description: https://datasheet.ciiva.com/48532/aoa0000ce1-48532159.pdf?src-supplier=Avnet; Supplier Part Number 1: P1.0KECT-ND; Depth: 1.6mm; Height: 0.6mm; Length: 3.2mm
R20-R31 R71 R72 R79 = RESISTOR 150R: RES SMD 150 OHM 5% 1/4W 1206; Manufacturer 1: Panasonic; Resistance: 150R; Temperature Coefficient: 200ppm/°C; Voltage Rating: 200V; Power Rating: 250mW; Supplier 1: Digi-Key; Manufacturer Part Number 1: ERJ-8GEYJ151V; Stock 1: 112821; Pricing 1: 1=0,10000, 10=0,06500, 100=0,02660, 1000=0,01195, 2500=0,01037 (USD); RoHS: Yes; Mount: Surface Mount; Case/Package: 1206; Weight: 0.000571oz; Contact Plating: Tin; Case Code (Imperial): 1206; Case Code (Metric): 3216; Min Operating Temperature: -55°C; Max Operating Temperature: 155°C; Tolerance: 5%; Composition: Thick Film; Packaging: Tape and Reel; Package Quantity: 1; Termination: SMD/SMT; Number of Terminations: 2; Military Standard: Not; Max Power Dissipation: 250mW; Voltage Rating (DC): 200V; Features: Automotive AEC-Q200; Length: 3.2mm; Height: 0.6mm; Width: 1.6mm; Depth: 1.6mm; Radiation Hardening: No; REACH SVHC: No SVHC; Lead Free: Lead Free; ComponentLink1URL: https://datasheet.ciiva.com/34303/1990341-34303679.pdf?src-supplier=Jameco; ComponentLink1Description: https://datasheet.ciiva.com/34303/1990341-34303679.pdf?src-supplier=Jameco; ComponentLink2URL: https://datasheet.ciiva.com/30146/4aoa0000ce1-30146493.pdf?src-supplier=Onlinecomponents.com; ComponentLink2Description: https://datasheet.ciiva.com/30146/4aoa0000ce1-30146493.pdf?src-supplier=Onlinecomponents.com; ComponentLink3URL: https://datasheet.ciiva.com/16771/70255313-16771855.pdf?src-supplier=Allied+Electronics; ComponentLink3Description: https://datasheet.ciiva.com/16771/70255313-16771855.pdf?src-supplier=Allied+Electronics; ComponentLink4URL: https://datasheet.ciiva.com/16773/70255313-16773382.pdf?src-supplier=Allied+Electronics; ComponentLink4Description: https://datasheet.ciiva.com/16773/70255313-16773382.pdf?src-supplier=Allied+Electronics; ComponentLink5URL: https://datasheet.ciiva.com/6082/1500035-6082279.pdf?src-supplier=Farnell; ComponentLink5Description: https://datasheet.ciiva.com/6082/1500035-6082279.pdf?src-supplier=Farnell; ComponentLink6URL: https://datasheet.ciiva.com/17207/aoa0000ce1-17207400.pdf?src-supplier=Avnet+Europe; ComponentLink6Description: https://datasheet.ciiva.com/17207/aoa0000ce1-17207400.pdf?src-supplier=Avnet+Europe; ComponentLink7URL: https://datasheet.ciiva.com/46377/1500035-46377050.pdf?src-supplier=Element14; ComponentLink7Description: https://datasheet.ciiva.com/46377/1500035-46377050.pdf?src-supplier=Element14; ComponentLink8URL: https://datasheet.ciiva.com/9185/aoa0000ce1-9185516.pdf?src-supplier=Avnet; ComponentLink8Description: https://datasheet.ciiva.com/9185/aoa0000ce1-9185516.pdf?src-supplier=Avnet; ComponentLink9URL: https://datasheet.ciiva.com/16513/aoa0000ce1-16513711.pdf?src-supplier=Avnet+Asia; ComponentLink9Description: https://datasheet.ciiva.com/16513/aoa0000ce1-16513711.pdf?src-supplier=Avnet+Asia; Supplier Part Number 1: P150ECT-ND
R64-R69 = RESISTOR 70R: Res Thick Film 1206(3216) 70 Ohm 5% 1/4W 200ppm/C Molded SMD Punched Carrier T/R; Manufacturer 1: Panasonic; Resistance: 1kR; Temperature Coefficient: 200ppm/°C; Power Rating: 250mW; Voltage Rating: 200V; Categoría: Resistencia; Supplier 1: Digi-Key; Manufacturer Part Number 1: ERJ-8GEYJ102V; Stock 1: 1414216; Pricing 1: 1=0,10000, 10=0,07400, 100=0,03010, 1000=0,01351, 2500=0,01172 (USD); RoHS: Yes; Mount: Surface Mount; Case/Package: 1206; Case Code (Metric): 3216; Case Code (Imperial): 1206; Contact Plating: Tin; Min Operating Temperature: -55°C; Max Operating Temperature: 155°C; Tolerance: 5%; Packaging: Tape and Reel; Composition: Thick Film; Package Quantity: 1; Number of Terminations: 2; Max Power Dissipation: 250mW; Voltage Rating (DC): 200V; Features: Automotive AEC-Q200; Termination: SMD/SMT; Military Standard: Not; Width: 0.063inch; Radiation Hardening: No; Lead Free: Lead Free; REACH SVHC: Unknown; ComponentLink1URL: https://datasheet.ciiva.com/24069/aoa0000ce1-37422-24069653.pdf?src-supplier=Mouser; ComponentLink1Description: https://datasheet.ciiva.com/24069/aoa0000ce1-37422-24069653.pdf?src-supplier=Mouser; ComponentLink2URL: https://datasheet.ciiva.com/30141/4aoa0000ce1-30141014.pdf?src-supplier=Onlinecomponents.com; ComponentLink2Description: https://datasheet.ciiva.com/30141/4aoa0000ce1-30141014.pdf?src-supplier=Onlinecomponents.com; ComponentLink3URL: https://datasheet.ciiva.com/43460/1500035-43460230.pdf?src-supplier=Farnell; ComponentLink3Description: https://datasheet.ciiva.com/43460/1500035-43460230.pdf?src-supplier=Farnell; ComponentLink4URL: https://datasheet.ciiva.com/17215/aoa0000ce1-17215321.pdf?src-supplier=Avnet+Europe; ComponentLink4Description: https://datasheet.ciiva.com/17215/aoa0000ce1-17215321.pdf?src-supplier=Avnet+Europe; ComponentLink5URL: https://datasheet.ciiva.com/46371/1500035-46371931.pdf?src-supplier=Element14; ComponentLink5Description: https://datasheet.ciiva.com/46371/1500035-46371931.pdf?src-supplier=Element14; ComponentLink6URL: https://datasheet.ciiva.com/28532/1678796-28532156.pdf?src-supplier=Element14; ComponentLink6Description: https://datasheet.ciiva.com/28532/1678796-28532156.pdf?src-supplier=Element14; ComponentLink7URL: https://datasheet.ciiva.com/46386/1500035-46386461.pdf?src-supplier=Element14; ComponentLink7Description: https://datasheet.ciiva.com/46386/1500035-46386461.pdf?src-supplier=Element14; ComponentLink8URL: https://datasheet.ciiva.com/48532/aoa0000ce1-48532159.pdf?src-supplier=Avnet; ComponentLink8Description: https://datasheet.ciiva.com/48532/aoa0000ce1-48532159.pdf?src-supplier=Avnet; Supplier Part Number 1: P1.0KECT-ND; Depth: 1.6mm; Height: 0.6mm; Length: 3.2mm
T4 = TRANSISTOR_BUZZ: TRANS NPN 45V 0.5A SOT23; Manufacturer 1: ON Semiconductor; Max Power Dissipation: 300mW; Max Collector Current: 500mA; Collector Base Voltage (VCBO): 50V; hFE Min: 160; Transition Frequency: 100MHz; Emitter Base Voltage (VEBO): 5V; Element Configuration: Single; Number of Elements: 1; Collector Emitter Saturation Voltage: 700mV; Supplier 1: Digi-Key; Manufacturer Part Number 1: BC817-25LT1G; Stock 1: 103204; Pricing 1: 1=0,15000, 10=0,14100, 100=0,05890, 500=0,04626, 1000=0,03213 (USD); RoHS: Yes; Case/Package: SOT-23-3; Number of Pins: 3; Contact Plating: Tin,Matte; Min Operating Temperature: -55°C; Max Operating Temperature: 150°C; Collector Emitter Voltage (VCEO): 45V; Packaging: Tape and Reel; Polarity: NPN; Power Dissipation: 300mW; Package Quantity: 1; Collector Emitter Breakdown Voltage: 45V; Max Breakdown Voltage: 45V; Max Frequency: 100MHz; Current Rating: 500mA; Frequency: 100MHz; Gain Bandwidth Product: 100MHz; Length: 2.9mm; Height: 0.94mm; Width: 1.3mm; Radiation Hardening: No; Lead Free: Lead Free; Halogen Free: Halogen Free; REACH SVHC: No SVHC; ComponentLink1URL: https://datasheet.ciiva.com/15138/getdatasheetpartid-38405-15138602.pdf?src-supplier=Verical; ComponentLink1Description: https://datasheet.ciiva.com/15138/getdatasheetpartid-38405-15138602.pdf?src-supplier=Verical; ComponentLink2URL: https://datasheet.ciiva.com/27748/2010413-27748829.pdf?src-supplier=Jameco; ComponentLink2Description: https://datasheet.ciiva.com/27748/2010413-27748829.pdf?src-supplier=Jameco; ComponentLink3URL: https://datasheet.ciiva.com/1195/bc817-16lt1-d-1195763.pdf?src-supplier=Element14; ComponentLink3Description: https://datasheet.ciiva.com/1195/bc817-16lt1-d-1195763.pdf?src-supplier=Element14; ComponentLink4URL: https://datasheet.ciiva.com/976/bc817-16lt1-d-976356.pdf?src-supplier=Digi-Key; ComponentLink4Description: https://datasheet.ciiva.com/976/bc817-16lt1-d-976356.pdf?src-supplier=Digi-Key; ComponentLink5URL: https://datasheet.ciiva.com/1195/bc817-16lt1-d-1195764.pdf?src-supplier=Element14; ComponentLink5Description: https://datasheet.ciiva.com/1195/bc817-16lt1-d-1195764.pdf?src-supplier=Element14; ComponentLink6URL: https://datasheet.ciiva.com/976/bc817-16lt1-d-976357.pdf?src-supplier=Digi-Key; ComponentLink6Description: https://datasheet.ciiva.com/976/bc817-16lt1-d-976357.pdf?src-supplier=Digi-Key; ComponentLink7URL: https://datasheet.ciiva.com/4722/bc817-16lt1-d-104560-4722229.pdf?src-supplier=Mouser; ComponentLink7Description: https://datasheet.ciiva.com/4722/bc817-16lt1-d-104560-4722229.pdf?src-supplier=Mouser; ComponentLink8URL: https://datasheet.ciiva.com/22641/bc817-16lt1-d-22641013.pdf?src-supplier=Farnell; ComponentLink8Description: https://datasheet.ciiva.com/22641/bc817-16lt1-d-22641013.pdf?src-supplier=Farnell; ComponentLink9URL: https://datasheet.ciiva.com/22664/1842041-22664101.pdf?src-supplier=Element14; ComponentLink9Description: https://datasheet.ciiva.com/22664/1842041-22664101.pdf?src-supplier=Element14; ComponentLink10URL: https://datasheet.ciiva.com/976/bc817-16lt1-d-976358.pdf?src-supplier=Digi-Key; ComponentLink10Description: https://datasheet.ciiva.com/976/bc817-16lt1-d-976358.pdf?src-supplier=Digi-Key; ComponentLink11URL: https://datasheet.ciiva.com/25996/bc817-16lt1-d-25996327.pdf?src-supplier=Avnet+Europe; ComponentLink11Description: https://datasheet.ciiva.com/25996/bc817-16lt1-d-25996327.pdf?src-supplier=Avnet+Europe; ComponentLink12URL: https://datasheet.ciiva.com/11197/bc817-16lt1-d-11197514.pdf?src-supplier=Avnet; ComponentLink12Description: https://datasheet.ciiva.com/11197/bc817-16lt1-d-11197514.pdf?src-supplier=Avnet; ComponentLink13URL: https://datasheet.ciiva.com/22664/bc817-16lt1-d-22664204.pdf?src-supplier=Element14; ComponentLink13Description: https://datasheet.ciiva.com/22664/bc817-16lt1-d-22664204.pdf?src-supplier=Element14; ComponentLink14URL: https://datasheet.ciiva.com/1196/bc817-16lt1-d-1196558.pdf?src-supplier=Element14; ComponentLink14Description: https://datasheet.ciiva.com/1196/bc817-16lt1-d-1196558.pdf?src-supplier=Element14; Supplier Part Number 1: BC817-25LT1GOSCT-ND
T5-T7 = MMPQ2222A: TRANS 4NPN 40V 0.5A 16SOIC; Manufacturer 1: ON Semiconductor / Fairchild; Max Power Dissipation: 1W; Max Collector Current: 500mA; Polarity: NPN; Collector Base Voltage (VCBO): 75V; Emitter Base Voltage (VEBO): 5V; Gain Bandwidth Product: 350MHz; hFE Min: 100; Collector Emitter Saturation Voltage: 1V; Transition Frequency: 300MHz; Number of Elements: 4; Supplier 1: Digi-Key; Manufacturer Part Number 1: MMPQ2222A; Stock 1: 16456; Pricing 1: 1=1,81000, 10=1,62600, 100=1,19650, 500=1,01240, 1000=0,85900 (USD); RoHS: Yes; Mount: Surface Mount; Case/Package: SOIC; Number of Pins: 16; Weight: 0.143g; Min Operating Temperature: -55°C; Max Operating Temperature: 150°C; Packaging: Tape and Reel; Collector Emitter Voltage (VCEO): 40V; Package Quantity: 1; Collector Emitter Breakdown Voltage: 40V; Max Breakdown Voltage: 40V; Frequency: 300MHz; Power Dissipation: 1W; Max Frequency: 300MHz; Length: 10mm; Height: 1.5mm; Width: 4mm; Radiation Hardening: No; Lead Free: Lead Free; REACH SVHC: No SVHC; Supplier Part Number 1: MMPQ2222ACT-ND
  T5: ComponentLink5URL: https://datasheet.ciiva.com/968/ffb2222a-968058.pdf?src-supplier=Digi-Key; ComponentLink5Description: DATASHEET
  T6 T7: ComponentLink1URL: https://datasheet.ciiva.com/968/ffb2222a-968058.pdf?src-supplier=Digi-Key; ComponentLink1Description: DATASHEET
T14-T16 = TRANSISTOR: MOSFET N-CH 35V 3A CPH3; Manufacturer 1: ON Semiconductor; Rds On Max: 104mR; Input Capacitance: 186pF; Rise Time: 4.7ns; Max Power Dissipation: 1W; Drain to Source Resistance: 108mR; Turn-On Delay Time: 4.2ns; Turn-Off Delay Time: 15ns; Fall Time: 5.7ns; Element Configuration: Single; Gate to Source Voltage (Vgs): 20V; Supplier 1: RSComponents; Manufacturer Part Number 1: CPH3455-TL-H; Stock 1: 2250; Pricing 1: 50=0,09600, 100=0,16000, 250=0,15300, 500=0,14600, 1000=0,11600 (EUR); RoHS: Yes; Case/Package: SC; Number of Pins: 3; Min Operating Temperature: -55°C; Max Operating Temperature: 150°C; Package Quantity: 3000; Packaging: Tape and Reel; Drain to Source Voltage (Vdss): 35V; Continuous Drain Current (ID): 3A; Drain to Source Breakdown Voltage: 35V; Power Dissipation: 1W; Length: 2.9mm; Height: 0.9mm; Width: 1.6mm; Lead Free: Lead Free; Halogen Free: Halogen Free; ComponentLink1URL: https://datasheet.ciiva.com/4444/cph3455-d-91653-4444616.pdf?src-supplier=Mouser; ComponentLink1Description: https://datasheet.ciiva.com/4444/cph3455-d-91653-4444616.pdf?src-supplier=Mouser; ComponentLink2URL: https://datasheet.ciiva.com/11164/cph3455-d-11164889.pdf?src-supplier=Avnet; ComponentLink2Description: https://datasheet.ciiva.com/11164/cph3455-d-11164889.pdf?src-supplier=Avnet; ComponentLink3URL: https://datasheet.ciiva.com/947/cph3455-d-947201.pdf?src-supplier=Digi-Key; ComponentLink3Description: https://datasheet.ciiva.com/947/cph3455-d-947201.pdf?src-supplier=Digi-Key; Supplier Part Number 1: 8009989; Category: Transistor
U1a U4a = SN74HC164D: IC, SHIFT REGISTER, SMD, 74HC164; Manufacturer 1: Texas Instruments; Number of Elements: 1; Max Supply Voltage: 6V; Min Supply Voltage: 2V; Propagation Delay: 30ns; Number of Bits per Element: 8; Operating Supply Voltage: 5V; Direction: Unidirectional; Number of Input Lines: 2; Turn-On Delay Time: 255ns; Supplier 1: Digi-Key; Manufacturer Part Number 1: SN74HC164D; Stock 1: 1795; Pricing 1: 1=0,39000, 10=0,33800, 25=0,31520, 100=0,25200, 250=0,23400, 500=0,19800, 1000=0,15300, 2500=0,13950, 5000=0,13050 (USD); RoHS: Yes; Mount: Surface Mount; Case/Package: SOIC; Number of Pins: 14; Weight: 0.004318oz; Min Operating Temperature: -40°C; Max Operating Temperature: 125°C; Packaging: Rail/Tube; Logic Function: Shift Register; Package Quantity: 50; Number of Circuits: 1; Number of Output Lines: 8; Number of Bits: 8; Length: 8.65mm; Height: 1.58mm; Width: 3.91mm; Radiation Hardening: No; Lead Free: Lead Free; REACH SVHC: No SVHC; Supplier Part Number 1: 296-8247-5-ND; ComponentLink1Description: DATASHEET; ComponentLink1URL: https://datasheet.ciiva.com/15093/getdatasheetpartid-81705-15093317.pdf?src-supplier=Verical
X2 = Fuse 1: Fuse; Published: 8-Jun-2000; LatestRevisionDate: 17-Jul-2002; LatestRevisionNote: Re-released for DXP Platform.; PackageReference: PIN-W2/E2.8; Publisher: Altium Limited; PackageDescription: Thru-Hole; 2 Leads